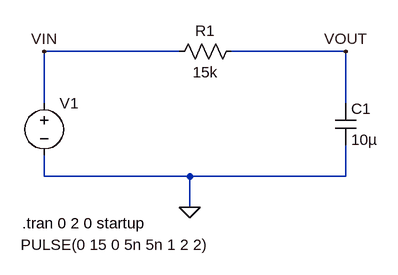
[diagram p0: schematic Experiment16.asc]
Experiment16.asc, the LTspice schematic file:
Version 4
SHEET 1 880 680
WIRE 80 48 -128 48
WIRE 336 48 160 48
WIRE -128 128 -128 48
WIRE 336 128 336 48
WIRE -128 240 -128 208
WIRE 96 240 -128 240
WIRE 336 240 336 192
WIRE 336 240 96 240
WIRE 96 288 96 240
FLAG 96 288 0
FLAG -128 48 VIN
FLAG 336 48 VOUT
SYMBOL voltage -128 112 R0
WINDOW 3 -36 233 Left 2
WINDOW 123 0 0 Left 0
WINDOW 39 0 0 Left 0
SYMATTR InstName V1
SYMATTR Value PULSE(0 15 0 5n 5n 1 2 2)
SYMBOL cap 320 128 R0
SYMATTR InstName C1
SYMATTR Value 10µ
SYMBOL res 176 32 R90
WINDOW 0 0 56 VBottom 2
WINDOW 3 32 56 VTop 2
SYMATTR InstName R1
SYMATTR Value 15k
TEXT -162 312 Left 2 !.tran 0 2 0 startup

The netlist it stands for:
* Experiment16.asc
V1 VIN 0 PULSE(0 15 0 5n 5n 1 2 2)
C1 VOUT 0 10µ
R1 VOUT VIN 15k
.tran 0 2 0 startup
.backanno
.end